# EAGLE design pico-hd6303 (EAGLE 9.6.2)
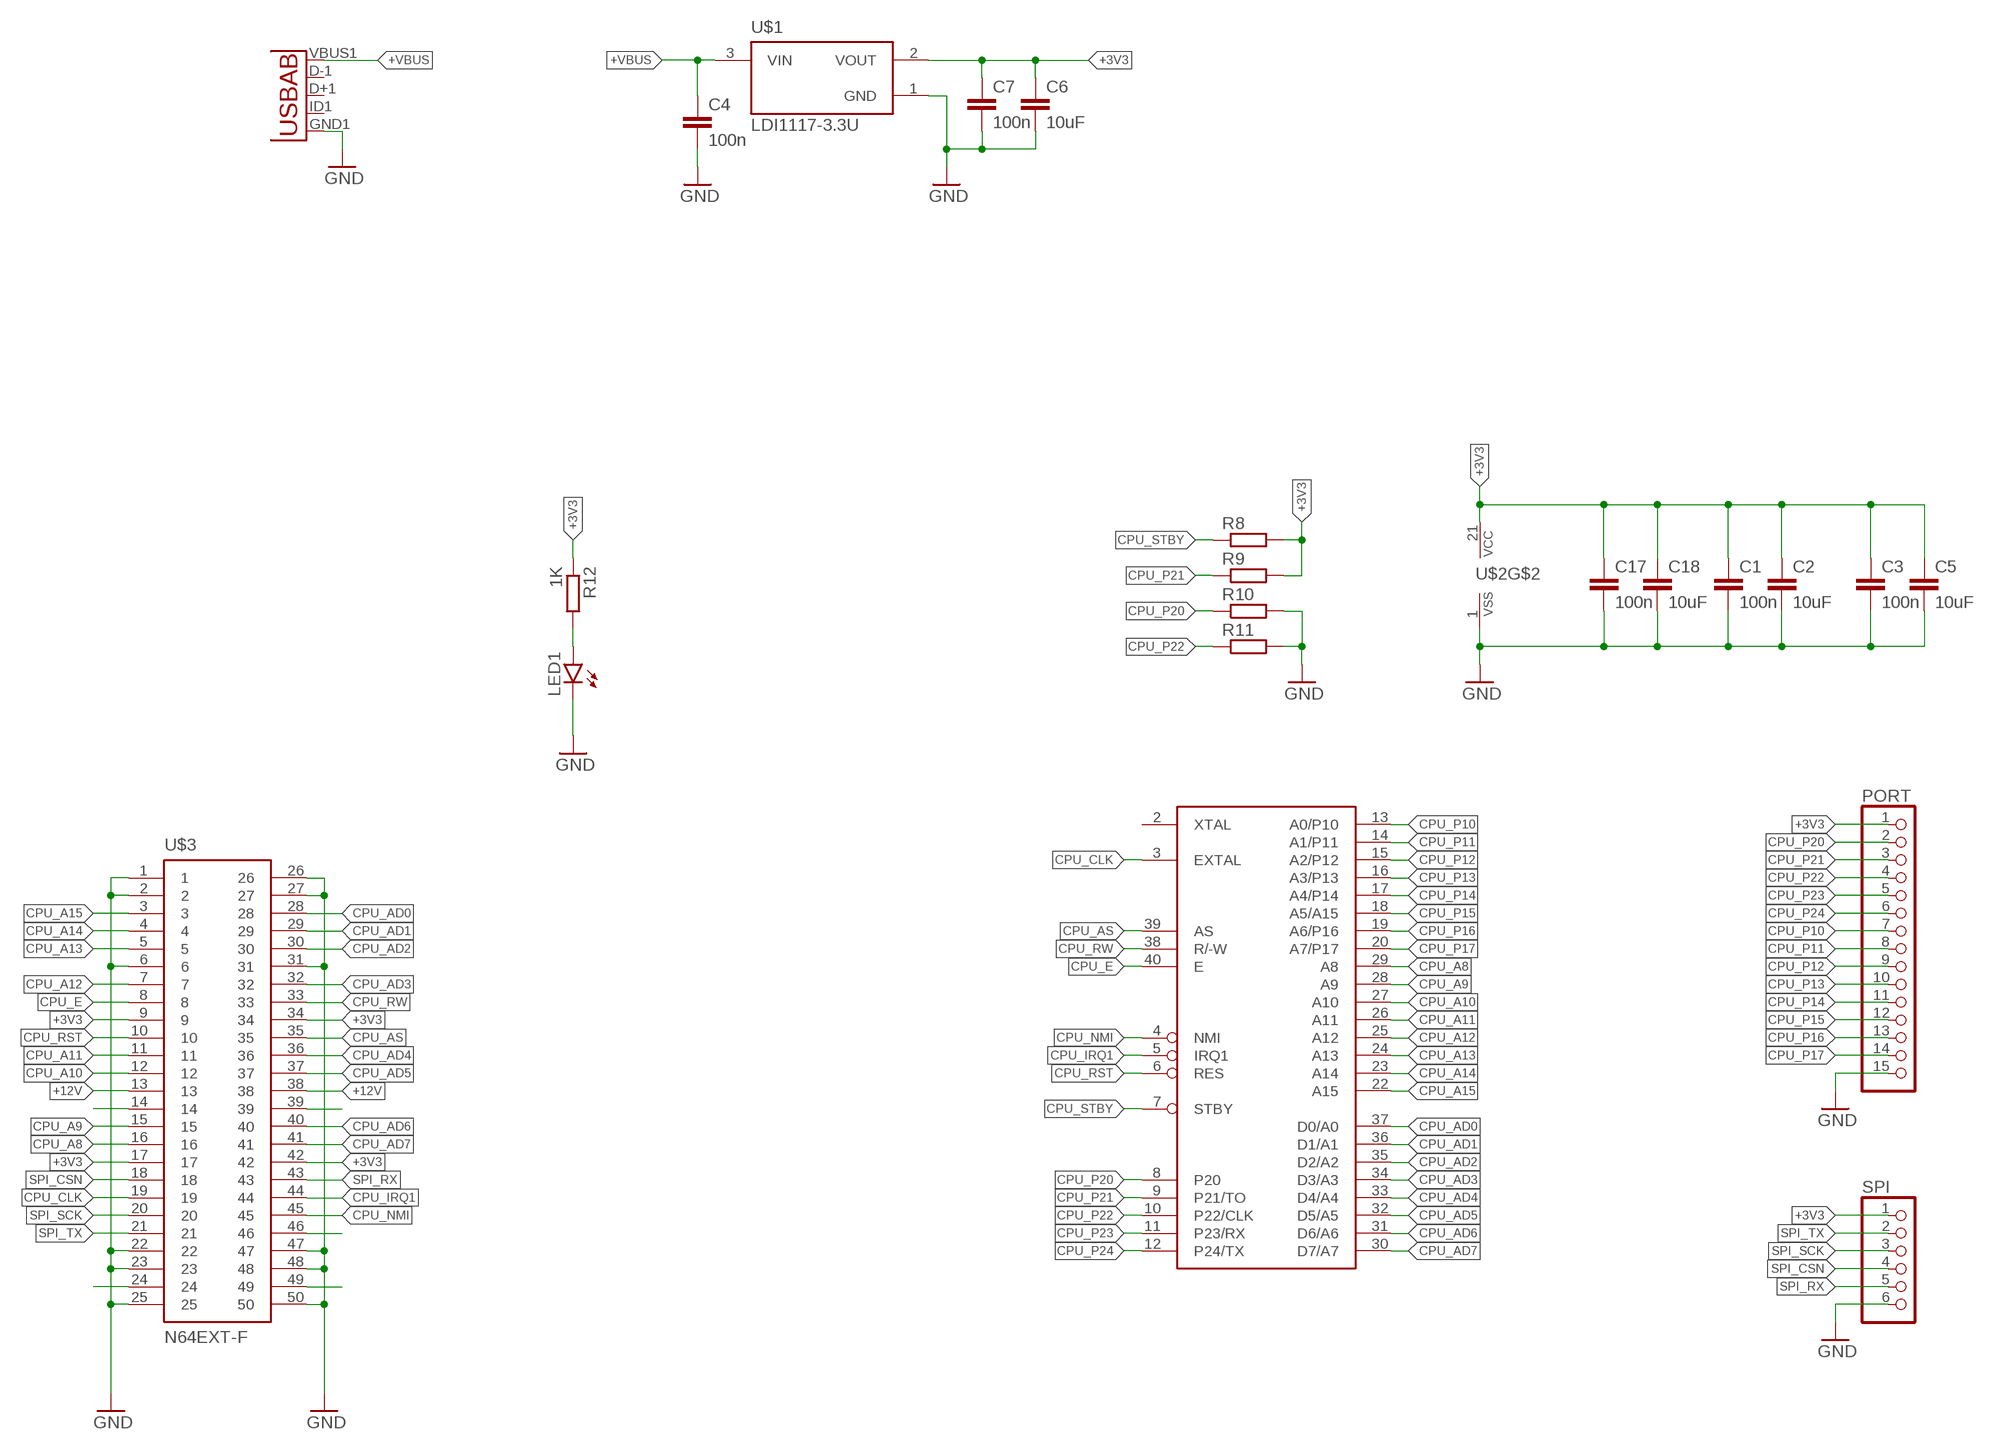
[diagram p0: schematic, sheet 1]

## Parts
C1  100n  C-EUC0603  [C0603]
C2  10uF  C-EUC0805  [C0805]
C3  100n  C-EUC0603  [C0603]
C4  100n  C-EUC0402  [C0402]
C5  10uF  C-EUC0805  [C0805]
C6  10uF  C-EUC0805  [C0805]
C7  100n  C-EUC0402  [C0402]
C17  100n  C-EUC0603  [C0603]
C18  10uF  C-EUC0805  [C0805]
LED1  LED5MM  [LED5MM]
PORT  PINHD-1X15  [1X15]
R8  R-EU_R0603  [R0603]
R9  R-EU_R0603  [R0603]
R10  R-EU_R0603  [R0603]
R11  R-EU_R0603  [R0603]
R12  1K  R-EU_R0603  [R0603]
SPI  PINHD-1X6  [1X06]
U2  USB""  [USB-MICRO-SMD]
U$1  LDI1117-3.3U  [LDI1117-3.3U]
U$2  HD63B03PRP  [DIL40]
U$3  N64EXT-F  [N64F]

## Nets
+3V3 [power]: C1.1 C2.1 C3.1 C5.1 C6.1 C7.1 C17.1 C18.1 PORT.1 R8.2 R9.2 R12.1 SPI.1 U$1.2(VOUT) U$2.21(VCC) U$3.9 U$3.17 U$3.34 U$3.42
+12V [power]: U$3.13 U$3.38
+VBUS [power]: C4.1 U2.VBUS1(VBUS) U$1.3(VIN)
CPU_A8: U$2.29(A8) U$3.16
CPU_A9: U$2.28(A9) U$3.15
CPU_A10: U$2.27(A10) U$3.12
CPU_A11: U$2.26(A11) U$3.11
CPU_A12: U$2.25(A12) U$3.7
CPU_A13: U$2.24(A13) U$3.5
CPU_A14: U$2.23(A14) U$3.4
CPU_A15: U$2.22(A15) U$3.3
CPU_AD0: U$2.37(D0/A0) U$3.28
CPU_AD1: U$2.36(D1/A1) U$3.29
CPU_AD2: U$2.35(D2/A2) U$3.30
CPU_AD3: U$2.34(D3/A3) U$3.32
CPU_AD4: U$2.33(D4/A4) U$3.36
CPU_AD5: U$2.32(D5/A5) U$3.37
CPU_AD6: U$2.31(D6/A6) U$3.40
CPU_AD7: U$2.30(D7/A7) U$3.41
CPU_AS: U$2.39(AS) U$3.35
CPU_CLK: U$2.3(EXTAL) U$3.19
CPU_E: U$2.40(E) U$3.8
CPU_IRQ1: U$2.5(IRQ1) U$3.44
CPU_NMI: U$2.4(NMI) U$3.45
CPU_P10: PORT.7 U$2.13(A0/P10)
CPU_P11: PORT.8 U$2.14(A1/P11)
CPU_P12: PORT.9 U$2.15(A2/P12)
CPU_P13: PORT.10 U$2.16(A3/P13)
CPU_P14: PORT.11 U$2.17(A4/P14)
CPU_P15: PORT.12 U$2.18(A5/A15)
CPU_P16: PORT.13 U$2.19(A6/P16)
CPU_P17: PORT.14 U$2.20(A7/P17)
CPU_P20: PORT.2 R10.1 U$2.8(P20)
CPU_P21: PORT.3 R9.1 U$2.9(P21/TO)
CPU_P22: PORT.4 R11.1 U$2.10(P22/CLK)
CPU_P23: PORT.5 U$2.11(P23/RX)
CPU_P24: PORT.6 U$2.12(P24/TX)
CPU_RST: U$2.6(RES) U$3.10
CPU_RW: U$2.38(R/-W) U$3.33
CPU_STBY: R8.1 U$2.7(STBY)
GND [power]: C1.2 C2.2 C3.2 C4.2 C5.2 C6.2 C7.2 C17.2 C18.2 LED1.K(C) PORT.15 R10.2 R11.2 SPI.6 U2.GND1(GND) U$1.1(GND) U$2.1(VSS) U$3.1 U$3.2 U$3.6 U$3.22 U$3.23 U$3.25 U$3.26 U$3.27 U$3.31 U$3.47 U$3.48 U$3.50
N$1: U$3.14
N$2: U$3.39
N$3: U$3.46
N$4: U$3.49
N$5: U$3.24
N$6: LED1.A R12.2
SPI_CSN: SPI.4 U$3.18
SPI_RX: SPI.5 U$3.43
SPI_SCK: SPI.3 U$3.20
SPI_TX: SPI.2 U$3.21
Unconnected: U2.D+1(D+) U2.D-1(D-) U2.ID1(USBID) U$2.2(XTAL)

## Library data of the parts
C1 C3 C17 = rcl:C-EU: CAPACITOR, European symbol
C2 C5 C6 C18 = resistor:C-EU: CAPACITOR, European symbol
C4 C7 = rcl:C-EU: CAPACITOR, European symbol; SPICEPREFIX: C
LED1 = led:LED: LED OSRAM: - CHIPLED LG R971, LG N971, LY N971, LG Q971, LY Q971, LO R971, LY R971 LH N974, LH R974 LS Q976, LO Q976, LY Q976 LO Q996 - Hyper CHIPLED LW Q18S LB Q993, LB Q99A, LB R99A - SideLED LS A670, LO A670, LY A670, LG A670, LP A670 LB A673, LV A673, LT A673, LW A673 LH A674 LY A675 LS A676, LA A676, LO A676, LY A676, LW A676 LS A679, LY A679, LG A679 - Hyper Micro SIDELED® LS Y876, LA Y876, LO Y876, LY Y876 LT Y87S - SmartLED LW L88C, LW L88S LB L89C, LB L89S, LG L890 LS L89K, LO L89K, LY L89K LS L896, LA L896, LO L896, LY L896 - TOPLED LS T670, LO T670, LY T670, LG T670, LP T670 LSG T670, LSP T670, LSY T670, LOP T670, LYG T670 LG T671, LOG T671, LSG T671 LB T673, LV T673, LT T673, LW T673 LH T674 LS T676, LA T676, LO T676, LY T676, LB T676, LH T676, LSB T676, LW T676 LB T67C, LV T67C, LT T67C, LS T67K, LO T67K, LY T67K, LW E67C LS E67B, LA E67B, LO E67B, LY E67B, LB E67C, LV E67C, LT E67C LW T67C LS T679, LY T679, LG T679 LS T770, LO T770, LY T770, LG T770, LP T770 LB T773, LV T773, LT T773, LW T773 LH T774 LS E675, LA E675, LY E675, LS T675 LS T776, LA T776, LO T776, LY T776, LB T776 LHGB T686 LT T68C, LB T68C - Hyper Mini TOPLED® LB M676 - Mini TOPLED Santana® LG M470 LS M47K, LO M47K, LY M47K Source: http://www.osram.convergy.de LUXEON: - LUMILED® LXK2-PW12-R00, LXK2-PW12-S00, LXK2-PW14-U00, LXK2-PW14-V00 LXK2-PM12-R00, LXK2-PM12-S00, LXK2-PM14-U00 LXK2-PE12-Q00, LXK2-PE12-R00, LXK2-PE12-S00, LXK2-PE14-T00, LXK2-PE14-U00 LXK2-PB12-K00, LXK2-PB12-L00, LXK2-PB12-M00, LXK2-PB14-N00, LXK2-PB14-P00, LXK2-PB14-Q00 LXK2-PR12-L00, LXK2-PR12-M00, LXK2-PR14-Q00, LXK2-PR14-R00 LXK2-PD12-Q00, LXK2-PD12-R00, LXK2-PD12-S00 LXK2-PH12-R00, LXK2-PH12-S00 LXK2-PL12-P00, LXK2-PL12-Q00, LXK2-PL12-R00 Source: www.luxeon.com KINGBRIGHT: KA-3528ASYC Source: www.kingbright.com
PORT = pinhead:PINHD-1X15: PIN HEADER
R8-R12 = rcl:R-EU_: RESISTOR, European symbol; SPICEPREFIX: R
SPI = pinhead:PINHD-1X6: PIN HEADER
U2 = MicroUSB:USB: This is a USB AB connector that is compatible with USB OTG. i.e. this connector can serve as a host or device
U$1 = LDI1117-3.3U:LDI1117-3.3U
U$2 = oldchips:HD63B03PR: 8 BIT CPU
U$3 = 5530841-5:N64EXT-F

## Net classes
0 default: width 0.152 mm
1 power: width 0.457 mm

## Board
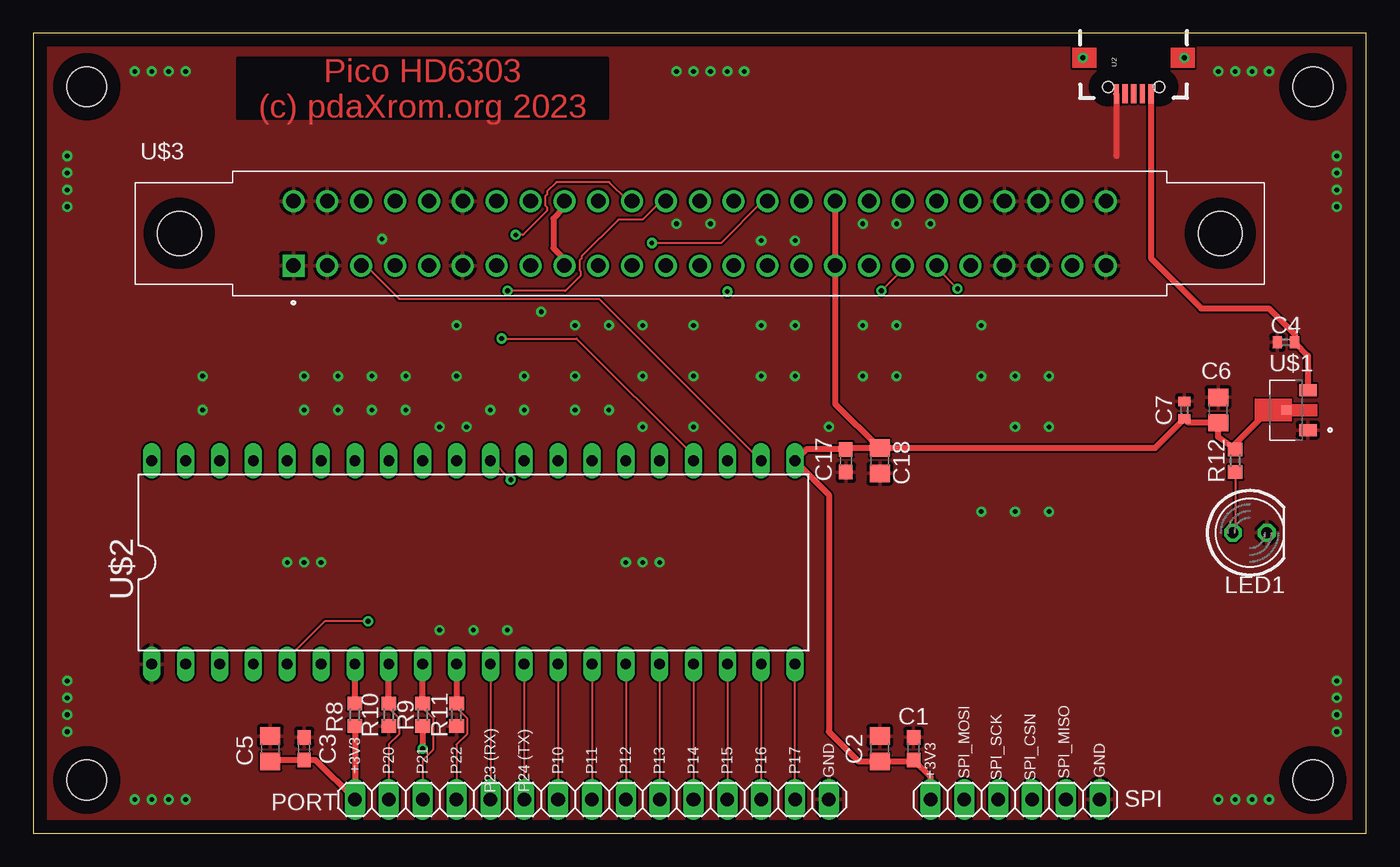
[diagram p1: board, top side]
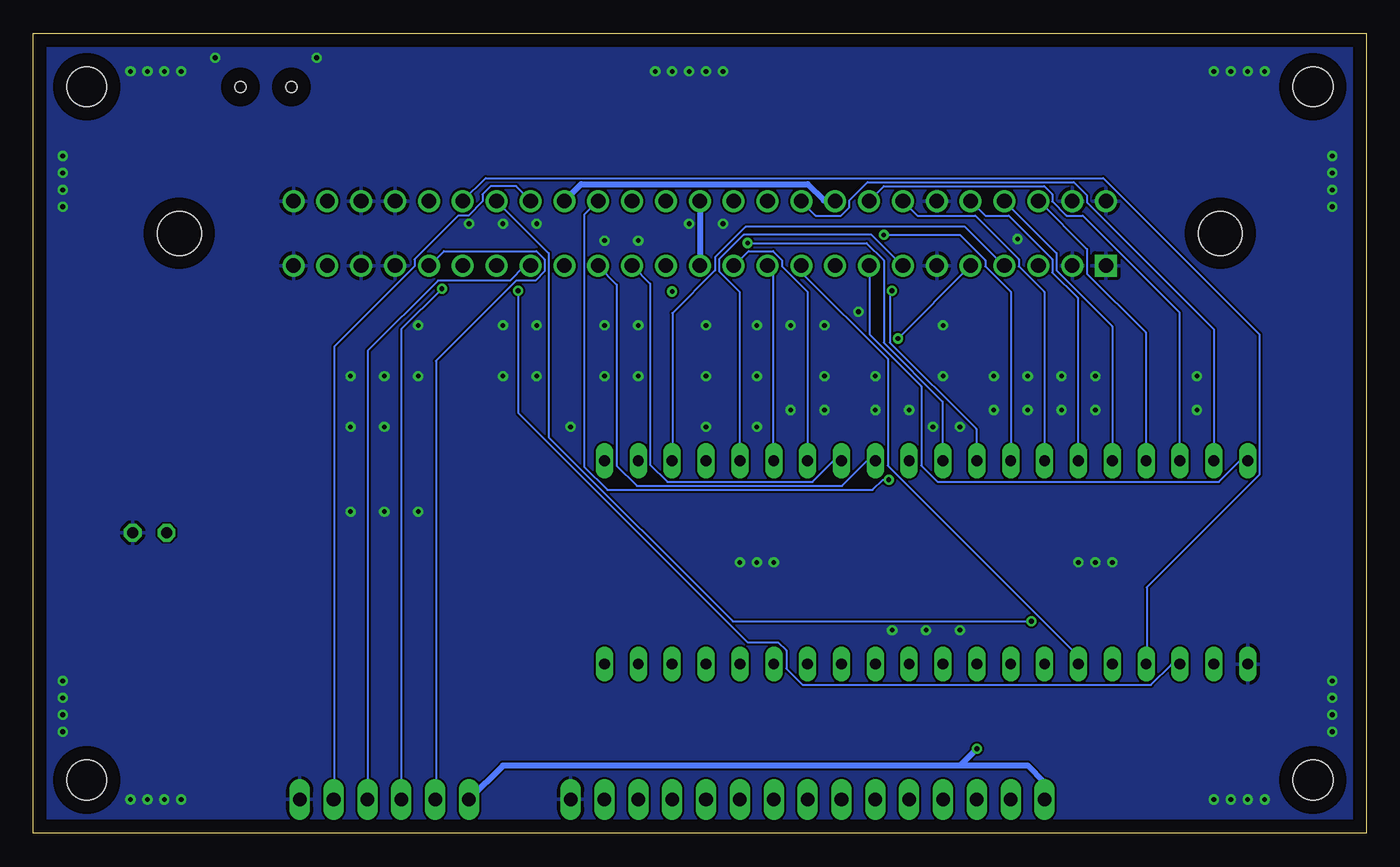
[diagram p2: board, bottom side, seen from below]

Size 100 x 60 mm. Coordinates in mm from the lower left corner, seen from the top.
Outline: 0,0 100,0 100,60 0,60 0,0
Copper layers (1*16): Top 0.035mm / dielectric 1.5mm / Bottom 0.035mm
Design rules "default *": minimum track width 6mil, minimum drill 0.35mm, track to track 6mil, track to pad 6mil, pad to pad 6mil, via to via 6mil, smd to smd 6mil, copper to edge 40mil, drill to drill 6mil, minimum pad ring 10mil, minimum via ring 8mil, stop-mask expansion 4mil, vias tented up to drill 0.4mm, thermal gap 10mil
Holes 3 mm at 96,4 4,56 4,4 96,56

### Footprints (pad centres in the part's own frame; a part is rotated, then mirrored left to right if it is on the bottom)
C0603 = smd 1.1 x 1: 1 -0.85,0; 2 0.85,0
C0805 = smd 1.3 x 1.5: 1 -0.95,0; 2 0.95,0
C0402 = smd 0.7 x 0.9: 1 -0.65,0; 2 0.65,0
LED5MM = drill 0.813 octagon: A -1.27,0; K 1.27,0
1X15 = drill 1.016 long: 1 -17.78,0; 2 -15.24,0; 3 -12.7,0; 4 -10.16,0; 5 -7.62,0; 6 -5.08,0; 7 -2.54,0; 8 0,0; 9 2.54,0; 10 5.08,0; 11 7.62,0; 12 10.16,0; 13 12.7,0; 14 15.24,0; 15 17.78,0
R0603 = smd 1 x 1.1: 1 -0.85,0; 2 0.85,0
1X06 = drill 1.016 long: 1 -6.35,0; 2 -3.81,0; 3 -1.27,0; 4 1.27,0; 5 3.81,0; 6 6.35,0
USB-MICRO-SMD = smd 1.4 x 0.4: D+1 2.7,0; D-1 2.7,0.65; GND1 2.7,-1.3; ID1 2.7,-0.65; VBUS1 2.7,1.3 | hole 0.85: 2.2,1.9; 2.2,-1.9
LDI1117-3.3U = smd 1.3 x 0.9: 1 -1.65,1.5; 3 -1.65,-1.5 | smd 0.7 x 0.7: 2 0,0
DIL40 = drill 0.813 long: 1 -24.13,-7.62; 2 -21.59,-7.62; 3 -19.05,-7.62; 4 -16.51,-7.62; 5 -13.97,-7.62; 6 -11.43,-7.62; 7 -8.89,-7.62; 8 -6.35,-7.62; 9 -3.81,-7.62; 10 -1.27,-7.62; 11 1.27,-7.62; 12 3.81,-7.62; 13 6.35,-7.62; 14 8.89,-7.62; 15 11.43,-7.62; 16 13.97,-7.62; 17 16.51,-7.62; 18 19.05,-7.62; 19 21.59,-7.62; 20 24.13,-7.62; 21 24.13,7.62; 22 21.59,7.62; 23 19.05,7.62; 24 16.51,7.62; 25 13.97,7.62; 26 11.43,7.62; 27 8.89,7.62; 28 6.35,7.62; 29 3.81,7.62; 30 1.27,7.62; 31 -1.27,7.62; 32 -3.81,7.62; 33 -6.35,7.62; 34 -8.89,7.62; 35 -11.43,7.62; 36 -13.97,7.62; 37 -16.51,7.62; 38 -19.05,7.62; 39 -21.59,7.62; 40 -24.13,7.62
N64F = drill 1.1 square: 1 -30.48,-2.425 | drill 1.1: 2 -27.94,-2.425; 3 -25.4,-2.425; 4 -22.86,-2.425; 5 -20.32,-2.425; 6 -17.78,-2.425; 7 -15.24,-2.425; 8 -12.7,-2.425; 9 -10.16,-2.425; 10 -7.62,-2.425; 11 -5.08,-2.425; 12 -2.54,-2.425; 13 0,-2.425; 14 2.54,-2.425; 15 5.08,-2.425; 16 7.62,-2.425; 17 10.16,-2.425; 18 12.7,-2.425; 19 15.24,-2.425; 20 17.78,-2.425; 21 20.32,-2.425; 22 22.86,-2.425; 23 25.4,-2.425; 24 27.94,-2.425; 25 30.48,-2.425; 26 -30.48,2.425; 27 -27.94,2.425; 28 -25.4,2.425; 29 -22.86,2.425; 30 -20.32,2.425; 31 -17.78,2.425; 32 -15.24,2.425; 33 -12.7,2.425; 34 -10.16,2.425; 35 -7.62,2.425; 36 -5.08,2.425; 37 -2.54,2.425; 38 0,2.425; 39 2.54,2.425; 40 5.08,2.425; 41 7.62,2.425; 42 10.16,2.425; 43 12.7,2.425; 44 15.24,2.425; 45 17.78,2.425; 46 20.32,2.425; 47 22.86,2.425; 48 25.4,2.425; 49 27.94,2.425; 50 30.48,2.425 | hole 3.3: -39.05,0; 39.05,0

### Placement (x,y rotation side)
C1  66.04,6.35 90 top
C2  63.5,6.35 90 top
C3  20.32,6.35 90 top
C4  93.98,36.83 180 top
C5  17.78,6.35 90 top
C6  88.9,31.75 90 top
C7  86.36,31.75 90 top
C17  60.96,27.94 270 top
C18  63.5,27.94 270 top
LED1  91.27,22.54 0 top
PORT  41.91,2.54 0 top
R8  24.13,8.89 270 top
R9  29.21,8.89 270 top
R10  26.67,8.89 270 top
R11  31.75,8.89 270 top
R12  90.17,27.94 270 top
SPI  73.66,2.54 0 top
U2  82.55,58.17 270 top
U$1  93.98,31.75 180 top
U$2  33.02,20.32 0 top
U$3  50,45 0 top

### Tracks (layer width: path | path; a pad name or v marks a point on that pad's centre or on a via)
+3V3  (via drill 0.35)
  Top 0.457: U$1.2 92.71,31.75 90.17,29.21 R12.1 88.9,29.71 C6.1 86.66,30.8 C7.1 84.15,28.89 C18.1 | C18.1 61.06,28.89 C17.1 58,28.79 U$2.21 59.69,25.4 59.69,7.62 61.91,5.4 C2.1 65.94,5.4 C1.1 67.31,4.23 SPI.1 | R8.2 PORT.1 21.17,5.5 C3.1 17.88,5.5 C5.1 | U$3.42 U$3.17 60.16,32.23 C18.1 | R9.2 v29.21,6.35 | U$3.9 39.78,42.6 39.78,43.13 39.01,43.89 39.01,46.1 39.78,46.86 39.78,47.4 U$3.34
  Bottom 0.457: PORT.1 24.13,3.81 25.4,5.08 30.48,5.08 | 30.48,5.08 64.77,5.08 SPI.1 | v29.21,6.35 30.48,5.08 | U$3.34 39.85,47.47 40.69,47.47 41.91,48.69 58.9,48.69 60.12,47.47 U$3.42
+12V
  Bottom 0.457: U$3.13 49.99,42.6 49.99,47.4 U$3.38
+VBUS
  Top 0.457: U2.VBUS1 83.85,43.15 87.63,39.37 92.71,39.37 94.63,37.45 C4.1 95.63,35.83 U$1.3
CPU_A8
  Bottom 0.152: U$2.29 36.88,27.89 37.49,27.89 39.32,26.06 54.71,26.06 56.24,27.58 56.24,41.15 57.61,42.52 U$3.16
CPU_A9
  Bottom 0.152: U$2.28 39.4,27.89 40.01,27.89 41.53,26.36 52.43,26.36 53.72,27.66 53.72,41.22 55.02,42.52 U$3.15
CPU_A10
  Bottom 0.152: U$2.27 41.91,40.62 43.81,42.52 43.81,42.98 44.5,43.66 46.33,43.66 47.4,42.6 U$3.12
CPU_A11
  Bottom 0.152: U$2.26 44.5,27.96 44.5,42.14 44.88,42.52 U$3.11
CPU_A12
  Bottom 0.152: U$2.25 47.02,27.96 47.02,40.62 48.54,42.14 48.54,43.05 46.71,44.88 37.11,44.88 34.82,42.6 U$3.7
CPU_A13  (via drill 0.35)
  Top 0.152: U$2.24 49.53,28.35 40.77,37.11 v35.13,37.11
  Bottom 0.152: v35.13,37.11 29.72,42.52 U$3.5
CPU_A14
  Bottom 0.152: U$2.23 52.05,27.96 52.05,39.01 48.84,42.22 48.84,43.2 46.56,45.49 30.1,45.49 27.2,42.6 U$3.4
CPU_A15
  Top 0.152: U$2.22 54.56,27.96 42.44,40.08 27.43,40.08 24.99,42.52 24.61,42.52 U$3.3
CPU_AD0
  Bottom 0.152: U$2.37 16.54,27.96 16.54,37.57 20.95,41.99 20.95,43.81 24.54,47.4 U$3.28
CPU_AD1
  Bottom 0.152: U$2.36 19.05,38.02 23.24,42.22 23.24,43.51 27.13,47.4 U$3.29
CPU_AD2
  Bottom 0.152: U$2.35 21.64,27.96 21.64,40.16 23.55,42.06 23.55,43.05 26.82,46.33 28.57,46.33 29.64,47.4 U$3.30
CPU_AD3
  Bottom 0.152: U$2.34 24.16,27.96 24.16,40.62 26.06,42.52 26.06,43.05 29.34,46.33 33.68,46.33 34.75,47.4 U$3.32
CPU_AD4  (via drill 0.35)
  Top 0.152: v36.2,44.88 36.73,44.88 38.56,46.71 38.56,46.94 38.41,47.09 38.41,47.78 38.56,47.93 38.56,48.16 39.24,48.84 43.2,48.84 44.58,47.47 44.88,47.47 U$3.36
  Bottom 0.152: U$2.33 26.67,40.62 28.57,42.52 28.57,42.98 30.48,44.88 v36.2,44.88
CPU_AD5  (via drill 0.35)
  Top 0.152: v35.59,40.69 39.93,40.69 41.07,41.83 41.07,42.14 41,42.22 41,42.98 41.15,43.13 41.15,43.28 43.89,46.02 45.72,46.02 47.09,47.4 47.4,47.4 U$3.37
  Bottom 0.152: v35.59,40.69 35.74,40.54 35.74,36.8 29.26,30.33 29.26,27.96 U$2.32
CPU_AD6  (via drill 0.35)
  Top 0.152: v46.41,44.27 51.59,44.27 54.71,47.4 55.02,47.4 U$3.40
  Bottom 0.152: v46.41,44.27 37.49,44.27 36.2,42.98 36.2,36.8 31.77,32.38 31.77,27.96 U$2.31
CPU_AD7  (via drill 0.35)
  Top 0.152: v35.81,26.52 34.44,27.89 34.29,27.89 U$2.30
  Bottom 0.152: v35.81,26.52 36.27,26.52 37.03,25.76 56.92,25.76 58.67,27.51 58.67,46.41 57.68,47.4 U$3.41
CPU_AS
  Bottom 0.152: U$2.39 11.43,37.8 20.95,47.32 20.95,47.85 21.95,48.84 37.41,48.84 38.79,47.47 38.79,46.94 39.4,46.33 41.3,46.33 42.37,47.4 U$3.35
CPU_CLK  (via drill 0.35)
  Top 0.152: v63.63,40.69 65.23,42.29 65.23,42.52 U$3.19
  Bottom 0.152: v63.63,40.69 63.63,31.55 46.41,14.33 44.12,14.33 43.51,13.72 43.51,12.34 42.29,11.12 16.15,11.12 14.63,12.65 14.02,12.65 U$2.3
CPU_E
  Bottom 0.152: U$2.40 8.91,27.89 9.53,27.89 11.05,26.36 32.16,26.36 33.38,27.58 33.38,33.53 37.26,37.41 37.26,42.52 U$3.8
CPU_IRQ1  (via drill 0.35)
  Top 0.152: U$2.5 19.05,13.11 21.84,15.9 v25.12,15.9
  Bottom 0.152: v25.12,15.9 47.52,15.9 61.34,29.72 61.34,43.51 65.23,47.4 U$3.44
CPU_NMI
  Bottom 0.152: U$2.4 16.46,12.72 16.46,18.44 8,26.9 8,37.41 19.74,49.15 66.06,49.15 67.74,47.47 U$3.45
CPU_P10
  Top 0.152: U$2.13 PORT.7
CPU_P11
  Top 0.152: U$2.14 PORT.8
CPU_P12
  Top 0.152: U$2.15 PORT.9
CPU_P13
  Top 0.152: U$2.16 PORT.10
CPU_P14
  Top 0.152: U$2.17 PORT.11
CPU_P15
  Top 0.152: U$2.18 PORT.12
CPU_P16
  Top 0.152: U$2.19 PORT.13
CPU_P17
  Top 0.152: PORT.14 U$2.20
CPU_P20
  Top 0.152: R10.1 26.67,9.41 27.45,8.63 27.45,7.45 26.67,6.67 PORT.2
  Top 0.457: R10.1 U$2.8
CPU_P21
  Top 0.152: R9.1 29.21,9.41 29.99,8.63 29.99,6.27 29.21,5.49 PORT.3
  Top 0.457: R9.1 U$2.9
CPU_P22
  Top 0.152: R11.1 31.75,9.41 32.53,8.63 32.53,7.45 31.75,6.67 PORT.4
  Top 0.457: U$2.10 R11.1
CPU_P23
  Top 0.152: U$2.11 PORT.5
CPU_P24
  Top 0.152: U$2.12 PORT.6
CPU_RST
  Bottom 0.152: U$2.6 21.64,12.72 21.64,13.34 35.89,27.58 35.89,35.59 42.37,42.06 42.37,42.52 U$3.10
CPU_RW
  Bottom 0.152: U$2.38 14.02,27.96 14.02,39.09 21.26,46.33 22.48,46.33 23.55,47.4 23.55,47.93 24.16,48.54 36.2,48.54 37.26,47.47 U$3.33
CPU_STBY
  Top 0.457: R8.1 U$2.7
GND  (via drill 0.35)
  Top 0.457: 81.28,50.8 81.25,50.83 U2.GND1
  other vias: 48.26,57.15 49.53,57.15 50.8,57.15 52.07,57.15 53.34,57.15 88.9,57.15 90.17,57.15 91.44,57.15 92.71,57.15 97.79,50.8 97.79,49.53 97.79,48.26 97.79,46.99 97.79,11.43 97.79,10.16 97.79,8.89 97.79,7.62 88.9,2.54 90.17,2.54 91.44,2.54 92.71,2.54 7.62,2.54 8.89,2.54 10.16,2.54 11.43,2.54 2.54,7.62 2.54,8.89 2.54,10.16 2.54,11.43 2.54,50.8 2.54,49.53 2.54,48.26 2.54,46.99 7.62,57.15 8.89,57.15 10.16,57.15 11.43,57.15 78.74,58.17 86.36,58.17 19.05,20.32 20.32,20.32 21.59,20.32 44.45,20.32 45.72,20.32 46.99,20.32 30.48,15.24 33.02,15.24 35.56,15.24 12.7,34.29 12.7,31.75 20.32,31.75 20.32,34.29 22.86,34.29 22.86,31.75 25.4,34.29 25.4,31.75 27.94,34.29 27.94,31.75 31.75,34.29 31.75,38.1 34.29,31.75 36.83,31.75 36.83,34.29 40.64,34.29 40.64,31.75 40.64,38.1 43.18,38.1 43.18,31.75 45.72,30.48 45.72,34.29 45.72,38.1 30.48,30.48 32.51,30.48 38.1,39.12 48.26,45.72 50.8,45.72 54.61,44.45 57.15,44.45 62.23,45.72 64.77,45.72 67.31,45.72 49.53,38.1 49.53,34.29 49.53,30.48 54.61,34.29 54.61,38.1 57.15,38.1 57.15,34.29 59.69,30.48 62.23,38.1 62.23,34.29 64.77,38.1 64.77,34.29 71.12,38.1 71.12,34.29 71.12,24.13 73.66,34.29 73.66,30.48 73.66,24.13 76.2,24.13 76.2,30.48 76.2,34.29 26.16,44.58
  pour Top: 0,0 0,59.69 100.33,59.69 100.33,0
  pour Bottom: 0,0 0,59.69 100.33,59.69 100.33,0
N$6
  Top 0.152: R12.2 90.17,22.71 LED1.A
N$11  (via drill 0.35)
  other vias: 52.07,40.64
SPI_CSN
  Bottom 0.152: SPI.4 74.91,2.59 74.91,36.2 69.65,41.45 64.24,41.45 63.17,42.52 62.71,42.52 U$3.18
SPI_RX
  Bottom 0.152: SPI.5 77.42,2.59 77.42,36.5 71.4,42.52 71.4,43.05 68.12,46.33 67.36,46.33 66.29,47.4 66.29,47.93 65.68,48.54 63.78,48.54 62.71,47.47 U$3.43
SPI_SCK  (via drill 0.35)
  Top 0.152: v69.34,40.84 67.82,42.37 67.82,42.52 U$3.20
  Bottom 0.152: SPI.3 72.39,37.8 v69.34,40.84
SPI_TX
  Bottom 0.152: SPI.2 69.8,2.59 69.8,35.43 63.78,41.45 62.33,41.45 61.65,42.14 61.65,43.05 62.26,43.66 69.19,43.66 70.26,42.6 U$3.21

### Text on the board
Top: Pico HD6303 / (c) pdaXrom.org 2023
tPlace: SPI_MOSI | SPI_MISO | +3V3 | SPI_SCK | SPI_CSN | P20 | P21 | P22 | P23 (RX) | P24 (TX) | P10 | P11 | P12 | P13 | P14 | P15 | P16 | P17 | GND | +3V3 | GND